# EasyEDA Pro project ProPrj_Altruist.epro, board PCB TH
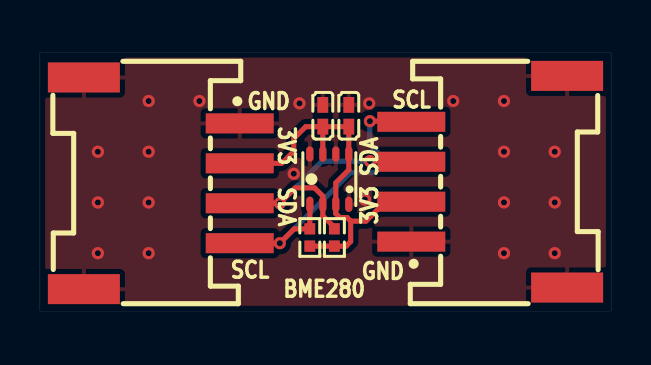
[diagram p5: board, top side]
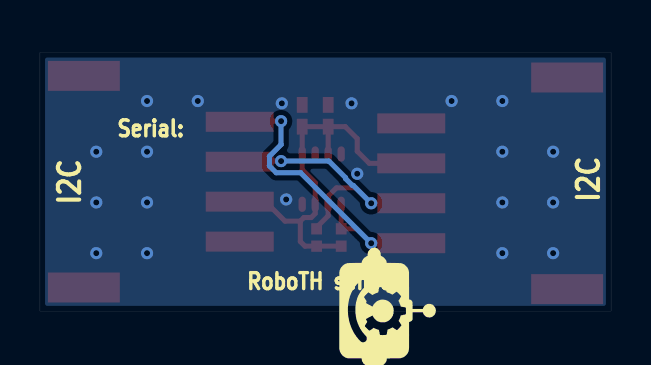
[diagram p6: board, bottom side, seen from below]

Outline 28.58 x 12.95 mm; copper layers: Top Layer, Bottom Layer. Coordinates in mm from the lower left corner of the outline.
Outline path: rectangle 0,12.95 28.58,0
Stack: Top Layer 0.035mm / Dielectric1 1.51mm FR4 er 4.5 / Bottom Layer 0.035mm

## Design rules (mm)
template: JLCPCB Capability(Two Layers Board)
spacing copperThickness1oz (default): track to track 0.102, other pairs 0.152 to 0.3
spacing copperThickness2oz: track to track 0.203, other pairs 0.152 to 0.3
track width copperThickness1oz (default): min 0.127, default 0.254, max 2.54
track width copperThickness2oz: min 0.203, default 0.254, max 2.54
differential pair differentialPair (default): width min 0.127, default 0.254, max 2.54; gap min 0.152, default 0.152
via viaSize (default): diameter min 0.5, default 0.61, max 10; hole min 0.3, default 0.305, max 6.3

## Placement (name value [footprint] x y rotation side)
C1  1uF  [C0402]  14.15 9.78 270 top
C2  100nF  [C0402]  15.45 9.78 90 top
R1  4.7kΩ  [R0402]  14.73 3.68 270 top
R2  4.7kΩ  [R0402]  13.5 3.68 270 top
SHT1  HY2.0-4P-C146060  [CONN-SMD_HY2.0-4P]  22.48 6.48 90 top
SHT2  HY2.0-4P-C146060  [CONN-SMD_HY2.0-4P]  6.1 6.4 270 top
U1  BME280  [LGA-8_BME280_BL]  14.48 6.6 270 top

## Footprints (pads in the part's own frame, mm; a bottom-side part is the same pattern mirrored in y, then rotated)
C0402
  rect 0.79x0.54 smd: 1(-0.545,0) 2(0.545,0)
CONN-SMD_HY2.0-4P
  rect 1x3.4 smd: 1(-3,3.9) 2(-1,3.9) 3(1,3.9) 4(3,3.9)
  rect 1.5x3.6 smd: 5(5.3,-3.9) 6(-5.3,-3.9)
LGA-8_BME280_BL
  oval 0.767x0.364 smd: 1(1.258,0.975) 2(1.258,0.325) 3(1.258,-0.325) 4(1.258,-0.975) 5(-1.258,-0.975) 6(-1.258,-0.325) 7(-1.258,0.325) 8(-1.258,0.975)
R0402
  rect 0.566x0.54 smd: 1(-0.433,0) 2(0.433,0)

## Nets
As in the schematic.

## Via types
v1: diameter 0.61, hole 0.305, Top Layer to Bottom Layer, 24 vias

## Routing (per net, layer and track width the routed paths; a pad name or vN(x,y) marks a point on that pad's centre or on a via; arc(x,y) is an arc through that point)
GND:
  vias: v1(2.9,7.98) v1(2.9,5.44) v1(2.9,2.9) v1(5.44,10.52) v1(5.44,7.98) v1(5.44,5.44) v1(5.44,2.9) v1(7.98,10.52) v1(12.7,6.87) v1(12.98,10.4) v1(16.26,5.59) v1(16.47,10.4) v1(20.68,10.52) v1(23.22,10.52) v1(23.22,7.98) v1(23.22,5.44) v1(23.22,2.9) v1(25.76,7.98) v1(25.76,5.44) v1(25.76,2.9)
VDD3V3: length 20.1
  Top Layer w0.254: 14.73,3.25 15.31,3.25 15.55,3.48 15.55,4.5 ; C1.2 U1.6 ; C1.2 13.3,9.23 12.7,8.64 12.7,8 12.1,7.4 SHT2.2 ; C1.2 C2.1 U1.8 15.45,7.07 14.8,6.42 U1.2 14.8,4.88 15,4.68 15.37,4.68 15.55,4.5 ; R1.2 R2.2 ; 15.55,4.5 16.31,4.5 17.29,5.48 SHT1.2
SCL: length 16.3
  Top Layer w0.254: SHT1.4 18.55,9.51 v1(16.51,9.51) ; U1.4 R2.1 12.72,4.12 v1(12,3.4) SHT2.4
  Bottom Layer w0.254: v1(16.51,9.51) 16.51,8.33 17.09,7.75 17.09,7.27 16.75,6.92 15.53,6.92 v1(12,3.4)
SDA: length 14
  Top Layer w0.254: R1.1 14.73,4.19 14.15,4.77 U1.3 14.15,5.76 13.74,6.17 12.77,6.17 v1(12,5.4) SHT2.3 ; SHT1.3 18.55,7.51 v1(16.51,7.51)
  Bottom Layer w0.254: v1(16.51,7.51) 14.11,7.51 13.28,6.68 13.28,6.63 12.94,6.29 12.9,6.29 v1(12,5.4)

## Copper pours and planes (outline as drawn; the poured copper is in the pictures)
GND on Top Layer: -0.63,13.46 29.46,13.46 29.46,-0.89 -0.63,-0.89
GND on Bottom Layer: -0.39,13.46 28.96,13.46 28.96,-0.51 -0.39,-0.51

## Text on the board
Bottom Silkscreen Layer: RoboTH sensor | Serial: | I2C
Top Silkscreen Layer: BME280 | GND | 3V3 | SDA | SCL
